# Altium schematic sheet 交通灯.SchDoc
size A4
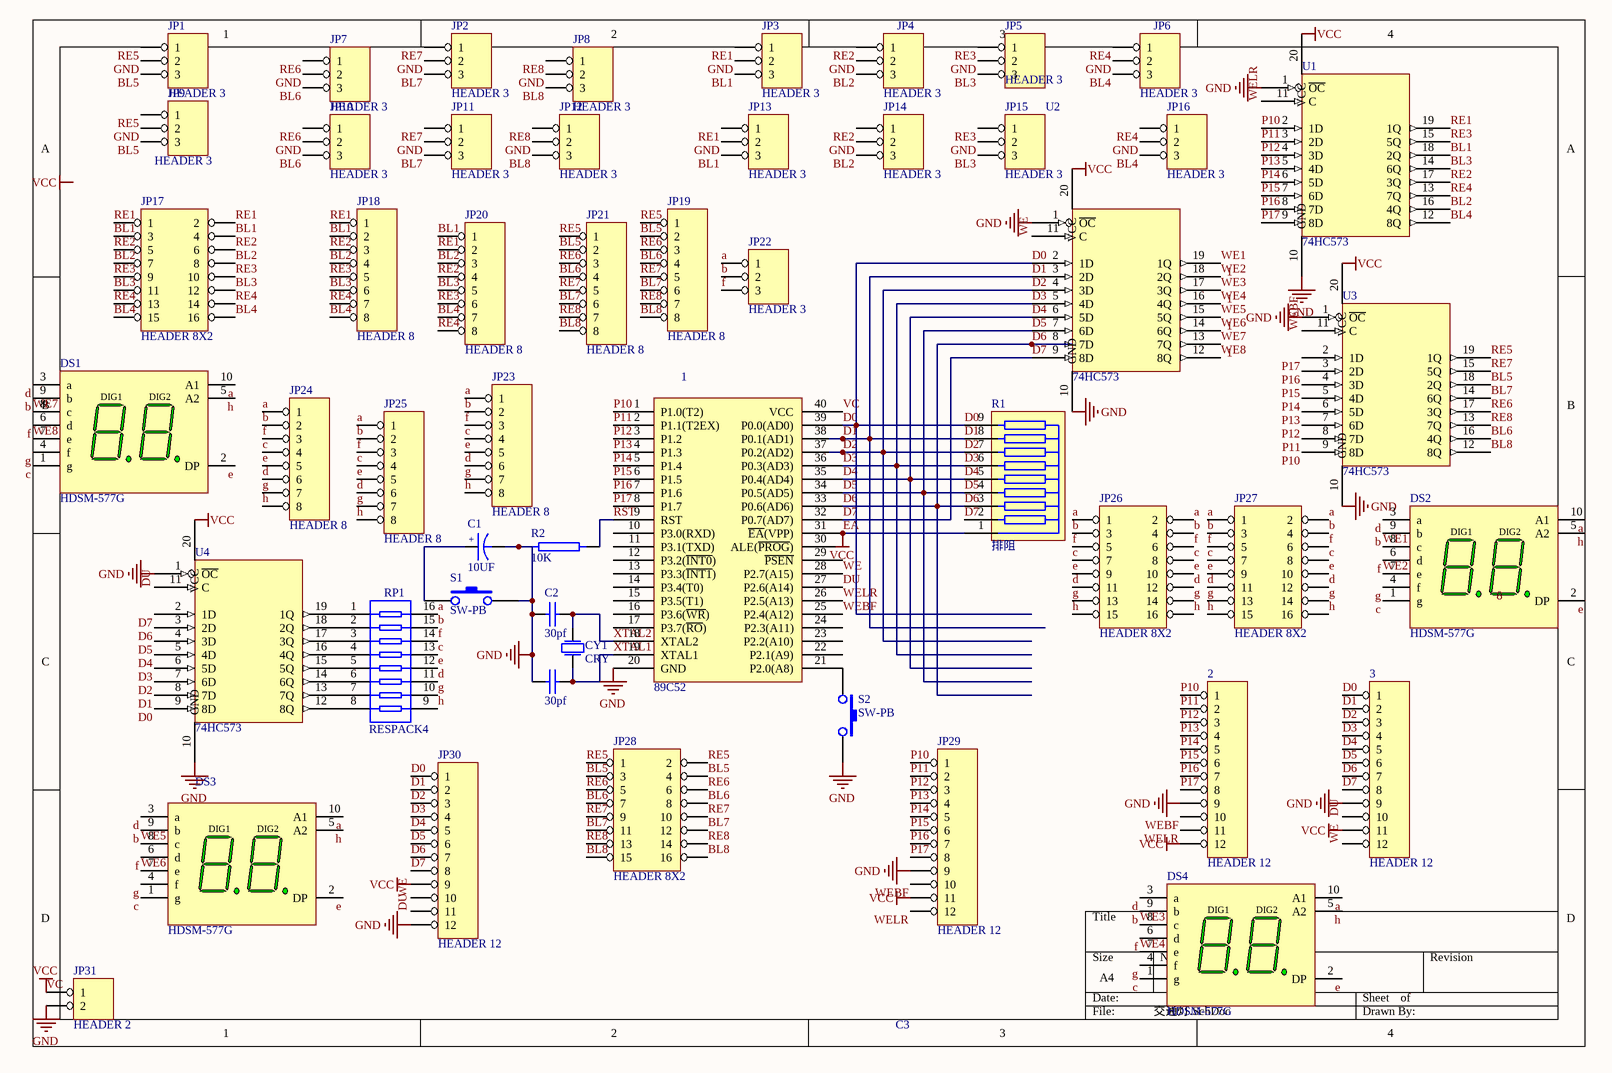
[diagram p0: 交通灯.SchDoc]

## Parts
1  89C52  [DIP-40]
2  HEADER 12  [HDR1X12]
3  HEADER 12  [HDR1X12]
C1  10UF  [3216C]
C2  30pf  [RAD0.1]
C3  30pf  [RAD0.1]
CY1  CRY  [XTAL-1]
DS1  HDSM-577G  [HDSM-577]
DS2  HDSM-577G  [HDSM-577]
DS3  HDSM-577G  [HDSM-577]
DS4  HDSM-577G  [HDSM-577]
JP1  HEADER 3  [Header3 80mil]
JP2  HEADER 3  [Header3 80mil]
JP3  HEADER 3  [Header3 80mil]
JP4  HEADER 3  [Header3 80mil]
JP5  HEADER 3  [Header3 80mil]
JP6  HEADER 3  [Header3 80mil]
JP7  HEADER 3  [Header3 80mil]
JP8  HEADER 3  [Header3 80mil]
JP9  HEADER 3  [Header3 80mil]
JP10  HEADER 3  [Header3 80mil]
JP11  HEADER 3  [Header3 80mil]
JP12  HEADER 3  [Header3 80mil]
JP13  HEADER 3  [Header3 80mil]
JP14  HEADER 3  [Header3 80mil]
JP15  HEADER 3  [Header3 80mil]
JP16  HEADER 3  [Header3 80mil]
JP17  HEADER 8X2  [HDR2X8]
JP18  HEADER 8  [HDR1X8]
JP19  HEADER 8  [HDR1X8]
JP20  HEADER 8  [HDR1X8]
JP21  HEADER 8  [HDR1X8]
JP22  HEADER 3  [Header3 80mil]
JP23  HEADER 8  [HDR1X8]
JP24  HEADER 8  [HDR1X8]
JP25  HEADER 8  [HDR1X8]
JP26  HEADER 8X2  [HDR2X8]
JP27  HEADER 8X2  [HDR2X8]
JP28  HEADER 8X2  [HDR2X8]
JP29  HEADER 12  [HDR1X12]
JP30  HEADER 12  [HDR1X12]
JP31  HEADER 2  [HDR1X2]
R1  排阻  [sip9]
R2  10K  [AXIAL0.5]
RP1  RESPACK4  [DIP16]
S1  SW-PB  [SWITCH]
S2  SW-PB  [SWITCH]
U1  74HC573  [DIP-20]
U2  74HC573  [DIP-20]
U3  74HC573  [DIP-20]
U4  74HC573  [DIP-20]

## Nets
EA: 1.31(~{EA}(VPP)) 1.40(VCC) 2.12 3.11 JP29.11 JP30.9 JP31.1 R1.1 U1.20(VCC) U2.20(VCC) U3.20(VCC) U4.20(VCC)  [also labelled VC, VCC]
GND: 1.20(GND) 2.9 3.9 C1.2 C2.2 C3.2 JP1.2 JP2.2 JP3.2 JP4.2 JP5.2 JP6.2 JP7.2 JP8.2 JP9.2 JP10.2 JP11.2 JP12.2 JP13.2 JP14.2 JP15.2 JP16.2 JP29.9 JP30.12 JP31.2 R2.1 S1.2 S2.2 U1.1(~{OC}) U1.10(GND) U2.1(~{OC}) U2.10(GND) U3.1(~{OC}) U3.10(GND) U4.1(~{OC}) U4.10(GND)
a: DS1.10(A1) DS2.10(A1) DS3.10(A1) DS4.10(A1) JP22.1 JP23.1 JP24.1 JP25.1 JP26.1 JP26.2 JP27.1 JP27.2 RP1.16
b: DS1.9(b) DS2.9(b) DS3.9(b) DS4.9(b) JP22.2 JP23.2 JP24.2 JP25.2 JP26.3 JP26.4 JP27.3 JP27.4 RP1.15
BL1: JP3.3 JP13.3 JP17.3 JP17.4 JP18.2 JP20.1 U1.18(2Q)
BL2: JP4.3 JP14.3 JP17.7 JP17.8 JP18.4 JP20.3 U1.16(4Q)
BL3: JP5.3 JP15.3 JP17.11 JP17.12 JP18.6 JP20.5 U1.14(6Q)
BL4: JP6.3 JP16.3 JP17.15 JP17.16 JP18.8 JP20.7 U1.12(8Q)
BL5: JP1.3 JP9.3 JP19.2 JP21.2 JP28.3 JP28.4 U3.18(2Q)
BL6: JP7.3 JP10.3 JP19.4 JP21.4 JP28.7 JP28.8 U3.16(4Q)
BL7: JP2.3 JP11.3 JP19.6 JP21.6 JP28.11 JP28.12 U3.14(6Q)
BL8: JP8.3 JP12.3 JP19.8 JP21.8 JP28.15 JP28.16 U3.12(8Q)
c: DS1.1(g) DS2.1(g) DS3.1(g) DS4.1(g) JP23.4 JP24.4 JP25.4 JP26.7 JP26.8 JP27.7 JP27.8 RP1.13
d: DS1.3(a) DS2.3(a) DS3.3(a) DS4.3(a) JP23.6 JP24.6 JP25.6 JP26.11 JP26.12 JP27.11 JP27.12 RP1.11
D0: 1.39(P0.0(AD0)) 3.1 JP30.1 R1.9 U2.2(1D) U4.9(8D)
D1: 1.38(P0.1(AD1)) 3.2 JP30.2 R1.8 U2.3(2D) U4.8(7D)
D2: 1.37(P0.2(AD2)) 3.3 JP30.3 R1.7 U2.4(3D) U4.7(6D)
D3: 1.36(P0.3(AD3)) 3.4 JP30.4 R1.6 U2.5(4D) U4.6(5D)
D4: 1.35(P0.4(AD4)) 3.5 JP30.5 R1.5 U2.6(5D) U4.5(4D)
D5: 1.34(P0.5(AD5)) 3.6 JP30.6 R1.4 U2.7(6D) U4.4(3D)
D6: 1.33(P0.6(AD6)) 3.7 JP30.7 R1.3 U2.8(7D) U4.3(2D)
D7: 1.32(P0.7(AD7)) 3.8 JP30.8 R1.2 U2.9(8D) U4.2(1D)
DU: 1.27(P2.6(A14)) 3.10 JP30.11 U4.11(C)
e: DS1.2(DP) DS2.2(DP) DS3.2(DP) DS4.2(DP) JP23.5 JP24.5 JP25.5 JP26.9 JP26.10 JP27.9 JP27.10 RP1.12
f: DS1.6(d) DS2.6(d) DS3.6(d) DS4.6(d) JP22.3 JP23.3 JP24.3 JP25.3 JP26.5 JP26.6 JP27.5 JP27.6 RP1.14
g: DS1.4(f) DS2.4(f) DS3.4(f) DS4.4(f) JP23.7 JP24.7 JP25.7 JP26.13 JP26.14 JP27.13 JP27.14 RP1.10
h: DS1.5(A2) DS2.5(A2) DS3.5(A2) DS4.5(A2) JP23.8 JP24.8 JP25.8 JP26.15 JP26.16 JP27.15 JP27.16 RP1.9
P10: 1.1(P1.0(T2)) 2.1 JP29.1 U1.2(1D) U3.9(8D)
P11: 1.2(P1.1(T2EX)) 2.2 JP29.2 U1.3(2D) U3.8(7D)
P12: 1.3(P1.2) 2.3 JP29.3 U1.4(3D) U3.7(6D)
P13: 1.4(P1.3) 2.4 JP29.4 U1.5(4D) U3.6(5D)
P14: 1.5(P1.4) 2.5 JP29.5 U1.6(5D) U3.5(4D)
P15: 1.6(P1.5) 2.6 JP29.6 U1.7(6D) U3.4(3D)
P16: 1.7(P1.6) 2.7 JP29.7 U1.8(7D) U3.3(2D)
P17: 1.8(P1.7) 2.8 JP29.8 U1.9(8D) U3.2(1D)
RE1: JP3.1 JP13.1 JP17.1 JP17.2 JP18.1 JP20.2 U1.19(1Q)
RE2: JP4.1 JP14.1 JP17.5 JP17.6 JP18.3 JP20.4 U1.17(3Q)
RE3: JP5.1 JP15.1 JP17.9 JP17.10 JP18.5 JP20.6 U1.15(5Q)
RE4: JP6.1 JP16.1 JP17.13 JP17.14 JP18.7 JP20.8 U1.13(7Q)
RE5: JP1.1 JP9.1 JP19.1 JP21.1 JP28.1 JP28.2 U3.19(1Q)
RE6: JP7.1 JP10.1 JP19.3 JP21.3 JP28.5 JP28.6 U3.17(3Q)
RE7: JP2.1 JP11.1 JP19.5 JP21.5 JP28.9 JP28.10 U3.15(5Q)
RE8: JP8.1 JP12.1 JP19.7 JP21.7 JP28.13 JP28.14 U3.13(7Q)
RST: 1.9(RST) R2.2
WE: 1.28(P2.7(A15)) 3.12 JP30.10 U2.11(C)
WE1: DS2.8(c) U2.19(1Q)
WE2: DS2.7(e) U2.18(2Q)
WE3: DS4.8(c) U2.17(3Q)
WE4: DS4.7(e) U2.16(4Q)
WE5: DS3.8(c) U2.15(5Q)
WE6: DS3.7(e) U2.14(6Q)
WE7: DS1.8(c) U2.13(7Q)
WE8: DS1.7(e) U2.12(8Q)
WEBF: 1.25(P2.4(A12)) 2.10 JP29.10 U3.11(C)
WELR: 1.26(P2.5(A13)) 2.11 JP29.12 U1.11(C)
XTAL1: 1.19(XTAL1) C3.1 CY1.2(P2)
XTAL2: 1.18(XTAL2) C2.1 CY1.1(P1)
Net1_21: 1.21(P2.0(A8)) S2.1
NetC1_1: C1.1 S1.1
NetRP1_1: RP1.1 U4.19(1Q)
NetRP1_2: RP1.2 U4.18(2Q)
NetRP1_3: RP1.3 U4.17(3Q)
NetRP1_4: RP1.4 U4.16(4Q)
NetRP1_5: RP1.5 U4.15(5Q)
NetRP1_6: RP1.6 U4.14(6Q)
NetRP1_7: RP1.7 U4.13(7Q)
NetRP1_8: RP1.8 U4.12(8Q)

Not connected (* = marked no-connect by the designer): 1 10(P3.0(RXD)) 11(P3.1(TXD)) 12(P3.2(~{INT0})) 13(P3.3(~{INT1})) 14(P3.4(T0)) 15(P3.5(T1)) 16(P3.6(~{WR})) 17(P3.7(~{RO})) 22(P2.1(A9)) 23(P2.2(A10)) 24(P2.3(A11)) 29(~{PSEN}) 30(ALE(~{PROG}))

## Notes on the sheet
- Labels drawn without touching a wire or pin: 1, 8, VCC
- (in symbol CAP-T) +
- (in symbol HDSM-577G) DIG1; DIG2

## Library data of the parts
2 3 JP29 JP30 = HEADER 12: 12 Pin Header
C1 = CAP-T: 钽电容
C2 C3 = CAP1
DS1-DS4 = HDSM-577G: 9.2 mm Green 7-Segment Display: 2-Digit, RH DP; Published: 26-May-2004; LatestRevisionDate: 11-Oct-2004; LatestRevisionNote: Display outline superimposed on PCB Footprint.; DatasheetVersion: 14-Mar-2003; PackageVersion: 14-Mar-2003; PackageReference: HDSM-577; Publisher: Altium Limited; PackageDescription: LED, 7-Segment Display, 9.2 mm, Dual Digit; 10 Leads; Row Space 10.7 mm; Pitch 2.54 mm; ComponentLink1Description: Manufacturer Link; ComponentLink1URL: http://www.avagotech.com/
JP18-JP21 JP23-JP25 = HEADER 8: 8 Pin Header
R2 = RES
RP1 = 8单路阻排